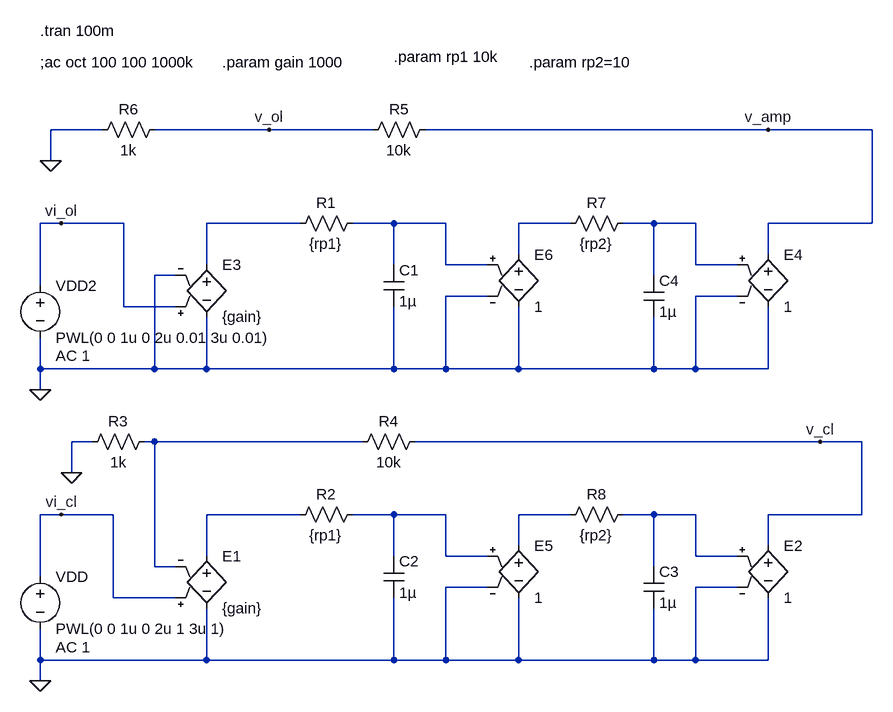
[diagram p0: schematic 2nd_order_step.asc]
2nd_order_step.asc, the LTspice schematic file:
Version 4
SHEET 1 1092 932
WIRE -928 -608 -1008 -608
WIRE -672 -608 -848 -608
WIRE -512 -608 -672 -608
WIRE 96 -608 -432 -608
WIRE 256 -608 96 -608
WIRE -1008 -560 -1008 -608
WIRE -992 -464 -1024 -464
WIRE -896 -464 -992 -464
WIRE -624 -464 -768 -464
WIRE -480 -464 -544 -464
WIRE -400 -464 -480 -464
WIRE -208 -464 -288 -464
WIRE -80 -464 -128 -464
WIRE -16 -464 -80 -464
WIRE 256 -464 256 -608
WIRE 256 -464 96 -464
WIRE -288 -416 -288 -464
WIRE 96 -416 96 -464
WIRE -768 -400 -768 -464
WIRE -480 -400 -480 -464
WIRE -400 -400 -400 -464
WIRE -336 -400 -400 -400
WIRE -16 -400 -16 -464
WIRE 48 -400 -16 -400
WIRE -816 -384 -848 -384
WIRE -80 -384 -80 -464
WIRE -1024 -368 -1024 -464
WIRE -336 -352 -400 -352
WIRE 48 -352 -16 -352
WIRE -896 -336 -896 -464
WIRE -816 -336 -896 -336
WIRE -1024 -240 -1024 -288
WIRE -848 -240 -848 -384
WIRE -848 -240 -1024 -240
WIRE -768 -240 -768 -320
WIRE -768 -240 -848 -240
WIRE -480 -240 -480 -336
WIRE -480 -240 -768 -240
WIRE -400 -240 -400 -352
WIRE -400 -240 -480 -240
WIRE -288 -240 -288 -336
WIRE -288 -240 -400 -240
WIRE -80 -240 -80 -320
WIRE -80 -240 -288 -240
WIRE -16 -240 -16 -352
WIRE -16 -240 -80 -240
WIRE 96 -240 96 -336
WIRE 96 -240 -16 -240
WIRE -1024 -208 -1024 -240
WIRE -944 -128 -976 -128
WIRE -848 -128 -864 -128
WIRE -528 -128 -848 -128
WIRE 176 -128 -448 -128
WIRE 240 -128 176 -128
WIRE -976 -80 -976 -128
WIRE -992 -16 -1024 -16
WIRE -912 -16 -992 -16
WIRE -624 -16 -768 -16
WIRE -480 -16 -544 -16
WIRE -400 -16 -480 -16
WIRE -208 -16 -288 -16
WIRE -80 -16 -128 -16
WIRE -16 -16 -80 -16
WIRE 240 -16 240 -128
WIRE 240 -16 96 -16
WIRE -288 32 -288 -16
WIRE 96 32 96 -16
WIRE -768 48 -768 -16
WIRE -480 48 -480 -16
WIRE -400 48 -400 -16
WIRE -336 48 -400 48
WIRE -16 48 -16 -16
WIRE 48 48 -16 48
WIRE -848 64 -848 -128
WIRE -816 64 -848 64
WIRE -80 64 -80 -16
WIRE -1024 80 -1024 -16
WIRE -336 96 -400 96
WIRE 48 96 -16 96
WIRE -912 112 -912 -16
WIRE -816 112 -912 112
WIRE -1024 208 -1024 160
WIRE -768 208 -768 128
WIRE -768 208 -1024 208
WIRE -480 208 -480 112
WIRE -480 208 -768 208
WIRE -400 208 -400 96
WIRE -400 208 -480 208
WIRE -288 208 -288 112
WIRE -288 208 -400 208
WIRE -80 208 -80 128
WIRE -80 208 -288 208
WIRE -16 208 -16 96
WIRE -16 208 -80 208
WIRE 96 208 96 112
WIRE 96 208 -16 208
WIRE -1024 240 -1024 208
FLAG -1024 240 0
FLAG -1024 -208 0
FLAG -992 -464 vi_ol
FLAG -1008 -560 0
FLAG -672 -608 v_ol
FLAG 96 -608 v_amp
FLAG -992 -16 vi_cl
FLAG 176 -128 v_cl
FLAG -976 -80 0
SYMBOL voltage -1024 64 R0
WINDOW 123 24 124 Left 2
WINDOW 39 0 0 Left 2
SYMATTR Value2 AC 1
SYMATTR InstName VDD
SYMATTR Value PWL(0 0 1u 0 2u 1 3u 1)
SYMBOL res -528 -480 R90
WINDOW 0 0 56 VBottom 2
WINDOW 3 32 56 VTop 2
SYMATTR InstName R1
SYMATTR Value {rp1}
SYMBOL cap -496 -400 R0
SYMATTR InstName C1
SYMATTR Value 1µ
SYMBOL e2 -768 -416 R0
SYMATTR InstName E3
SYMATTR Value {gain}
SYMBOL e 96 -432 R0
SYMATTR InstName E4
SYMATTR Value 1
SYMBOL res -416 -624 R90
WINDOW 0 0 56 VBottom 2
WINDOW 3 32 56 VTop 2
SYMATTR InstName R5
SYMATTR Value 10k
SYMBOL res -832 -624 R90
WINDOW 0 0 56 VBottom 2
WINDOW 3 32 56 VTop 2
SYMATTR InstName R6
SYMATTR Value 1k
SYMBOL e -288 -432 R0
SYMATTR InstName E6
SYMATTR Value 1
SYMBOL res -112 -480 R90
WINDOW 0 0 56 VBottom 2
WINDOW 3 32 56 VTop 2
SYMATTR InstName R7
SYMATTR Value {rp2}
SYMBOL cap -96 -384 R0
SYMATTR InstName C4
SYMATTR Value 1µ
SYMBOL voltage -1024 -384 R0
WINDOW 123 24 124 Left 2
WINDOW 39 0 0 Left 2
SYMATTR Value2 AC 1
SYMATTR InstName VDD2
SYMATTR Value PWL(0 0 1u 0 2u 0.01 3u 0.01)
SYMBOL res -528 -32 R90
WINDOW 0 0 56 VBottom 2
WINDOW 3 32 56 VTop 2
SYMATTR InstName R2
SYMATTR Value {rp1}
SYMBOL cap -496 48 R0
SYMATTR InstName C2
SYMATTR Value 1µ
SYMBOL e2 -768 32 R0
SYMATTR InstName E1
SYMATTR Value {gain}
SYMBOL res -848 -144 R90
WINDOW 0 0 56 VBottom 2
WINDOW 3 32 56 VTop 2
SYMATTR InstName R3
SYMATTR Value 1k
SYMBOL res -432 -144 R90
WINDOW 0 0 56 VBottom 2
WINDOW 3 32 56 VTop 2
SYMATTR InstName R4
SYMATTR Value 10k
SYMBOL e 96 16 R0
SYMATTR InstName E2
SYMATTR Value 1
SYMBOL e -288 16 R0
SYMATTR InstName E5
SYMATTR Value 1
SYMBOL res -112 -32 R90
WINDOW 0 0 56 VBottom 2
WINDOW 3 32 56 VTop 2
SYMATTR InstName R8
SYMATTR Value {rp2}
SYMBOL cap -96 64 R0
SYMATTR InstName C3
SYMATTR Value 1µ
TEXT -1024 -712 Left 2 !;ac oct 100 100 1000k
TEXT -744 -712 Left 2 !.param gain 1000
TEXT -480 -720 Left 2 !.param rp1 10k
TEXT -272 -712 Left 2 !.param rp2=10
TEXT -1024 -760 Left 2 !.tran 100m

The netlist it stands for:
* 2nd_order_step.asc
VDD vi_cl 0 PWL(0 0 1u 0 2u 1 3u 1) AC 1
R1 N002 N001 {rp1}
C1 N002 0 1µ
E3 N001 0 vi_ol 0 {gain}
E4 v_amp 0 N004 0 1
R5 v_amp v_ol 10k
R6 v_ol 0 1k
E6 N003 0 N002 0 1
R7 N004 N003 {rp2}
C4 N004 0 1µ
VDD2 vi_ol 0 PWL(0 0 1u 0 2u 0.01 3u 0.01) AC 1
R2 N007 N006 {rp1}
C2 N007 0 1µ
E1 N006 0 vi_cl N005 {gain}
R3 N005 0 1k
R4 v_cl N005 10k
E2 v_cl 0 N009 0 1
E5 N008 0 N007 0 1
R8 N009 N008 {rp2}
C3 N009 0 1µ
;ac oct 100 100 1000k
.param gain 1000
.param rp1 10k
.param rp2=10
.tran 100m
.backanno
.end

* Results of the author's LTspice run, read from the files saved beside the schematic
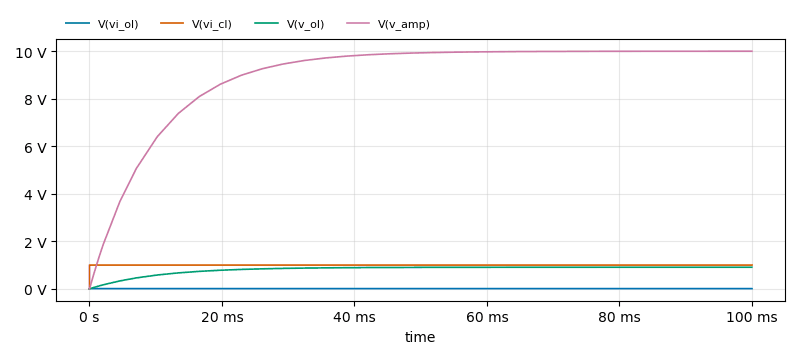
[diagram p1: Transient Analysis of 2nd_order_step.asc, plotted from the saved traces]
* Transient Analysis, 1 run:
*   V(vi_ol): min 0 V, max 10 mV, average 10 mV, rms 10 mV, last 10 mV
*   V(vi_cl): min 0 V, max 1 V, average 1 V, rms 1 V, last 1 V
*   V(v_ol): min 0 V, max 909 mV, average 817.6 mV, rms 837.9 mV, last 909 mV
*   V(v_amp): min 0 V, max 10 V, average 8.993 V, rms 9.217 V, last 10 V